# Altium schematic sheet GR740_GPIO.SchDoc
size A4
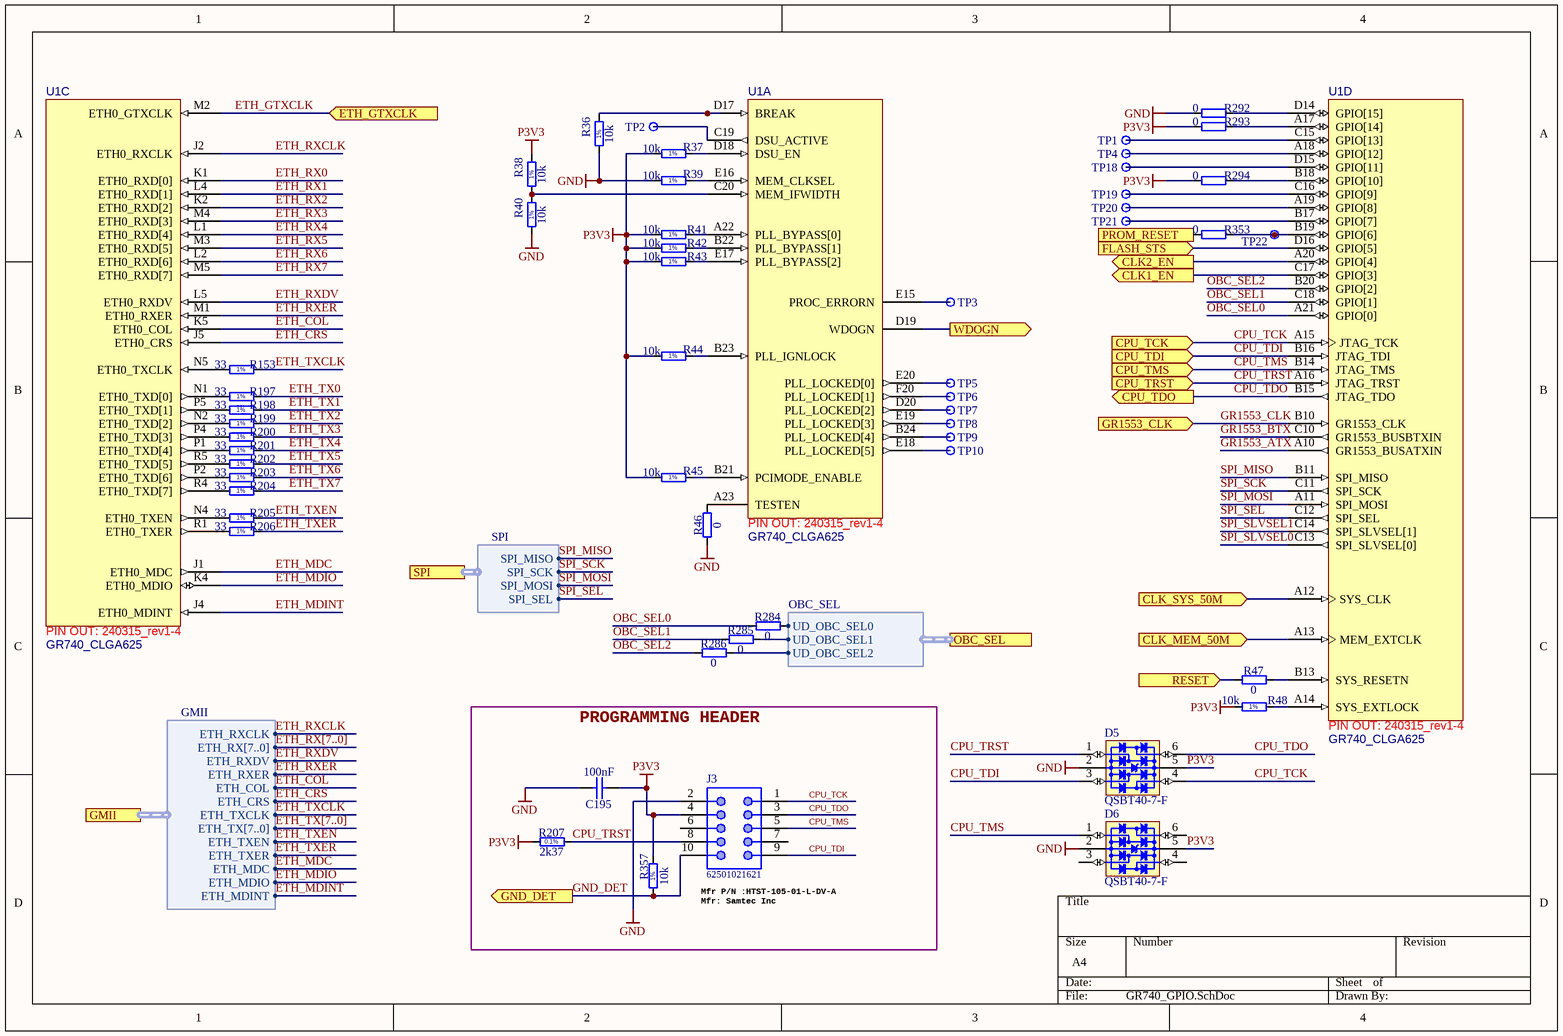
[diagram p0: GR740_GPIO.SchDoc]

## Parts
C195  100nF  [CAPC0603X33N]
D5  QSBT40-7-F  [SOT65P210X110-6N]
D6  QSBT40-7-F  [SOT65P210X110-6N]
J3  62501021621  [62501021621]
R36  10k  [RESC1005X40N]
R37  10k  [RESC1005X40N]
R38  10k  [RESC1005X40N]
R39  10k  [RESC1005X40N]
R40  10k  [RESC1005X40N]
R41  10k  [RESC1005X40N]
R42  10k  [RESC1005X40N]
R43  10k  [RESC1005X40N]
R44  10k  [RESC1005X40N]
R45  10k  [RESC1005X40N]
R46  0  [RESC1005X40N]
R47  0  [RESC1005X40N]
R48  10k  [RESC1005X40N]
R153  33  [RESC1005X40N]
R197  33  [RESC1005X40N]
R198  33  [RESC1005X40N]
R199  33  [RESC1005X40N]
R200  33  [RESC1005X40N]
R201  33  [RESC1005X40N]
R202  33  [RESC1005X40N]
R203  33  [RESC1005X40N]
R204  33  [RESC1005X40N]
R205  33  [RESC1005X40N]
R206  33  [RESC1005X40N]
R207  2k37  [RESC1608X55N]
R284  0  [RESC1005X40N]
R285  0  [RESC1005X40N]
R286  0  [RESC1005X40N]
R292  0  [RESC0603X28N]
R293  0  [RESC0603X28N]
R294  0  [RESC0603X28N]
R353  0  [RESC0603X28N]
R357  10k  [RESC1005X40N]
TP1  Test Point  [TPS127]  (value not drawn)
TP2  Test Point  [TPS127]  (value not drawn)
TP3  Test Point  [TPS127]  (value not drawn)
TP4  Test Point  [TPS127]  (value not drawn)
TP5  Test Point  [TPS127]  (value not drawn)
TP6  Test Point  [TPS127]  (value not drawn)
TP7  Test Point  [TPS127]  (value not drawn)
TP8  Test Point  [TPS127]  (value not drawn)
TP9  Test Point  [TPS127]  (value not drawn)
TP10  Test Point  [TPS127]  (value not drawn)
TP18  Test Point  [TPS127]  (value not drawn)
TP19  Test Point  [TPS127]  (value not drawn)
TP20  Test Point  [TPS127]  (value not drawn)
TP21  Test Point  [TPS127]  (value not drawn)
TP22  Test Point  [TPS127]  (value not drawn)
U1  GR740_CLGA625  [BGA625C100P25X25_3182X3182X1543]  (parts A,C,D of 10)

## Blocks framed on the sheet
PROGRAMMING HEADER: C195 J3 R207 R357

## Ports
CLK1_EN (out), CLK2_EN (out), CLK_MEM_50M (in), CLK_SYS_50M (in), CPU_TCK (in), CPU_TDI (in), CPU_TDO (out), CPU_TMS (in), CPU_TRST (in), ETH_GTXCLK (in), FLASH_STS (in), GMII (harness GMII), GND_DET (out), GR1553_CLK (in), OBC_SEL (harness OBC_SEL), PROM_RESET (out), RESET (in), SPI (harness SPI), WDOGN (out)

## Harnesses
GMII: ETH_RXCLK, ETH_RX[7..0], ETH_RXDV, ETH_RXER, ETH_COL, ETH_CRS, ETH_TXCLK, ETH_TX[7..0], ETH_TXEN, ETH_TXER, ETH_MDC, ETH_MDIO, ETH_MDINT
SPI: SPI_MISO, SPI_SCK, SPI_MOSI, SPI_SEL
OBC_SEL: UD_OBC_SEL0, UD_OBC_SEL1, UD_OBC_SEL2

## Nets
GND: C195.2 D5.2(GND) D6.2(GND) J3.2 R36.1 R39.1 R40.1 R46.1 R292.1
P3V3: C195.1 D5.5(VBUS) D6.5(VBUS) J3.4 R37.1 R38.2 R41.1 R42.1 R43.1 R44.1 R45.1 R48.1 R207.1 R293.1 R294.1 R357.2
CLK1_EN: U1.C17(GPIO[3]) ; port CLK1_EN
CLK2_EN: U1.A20(GPIO[4]) ; port CLK2_EN
CLK_MEM_50M: U1.A13(MEM_EXTCLK) ; port CLK_MEM_50M
CLK_SYS_50M: U1.A12(SYS_CLK) ; port CLK_SYS_50M
CPU_TCK: D5.4(I/O3) J3.1 U1.A15(JTAG_TCK) ; port CPU_TCK
CPU_TDI: D5.3(I/O2) J3.9 U1.B16(JTAG_TDI) ; port CPU_TDI
CPU_TDO: D5.6(I/O4) J3.3 U1.B15(JTAG_TDO) ; port CPU_TDO
CPU_TMS: D6.1(I/O1) J3.5 U1.B14(JTAG_TMS) ; port CPU_TMS
CPU_TRST: D5.1(I/O1) J3.8 R207.2 U1.A16(JTAG_TRST) ; port CPU_TRST
ETH_COL: U1.K5(ETH0_COL) ; port GMII.ETH_COL
ETH_CRS: U1.J5(ETH0_CRS) ; port GMII.ETH_CRS
ETH_GTXCLK: U1.M2(ETH0_GTXCLK) ; port ETH_GTXCLK
ETH_MDC: U1.J1(ETH0_MDC) ; port GMII.ETH_MDC
ETH_MDINT: U1.J4(ETH0_MDINT) ; port GMII.ETH_MDINT
ETH_MDIO: U1.K4(ETH0_MDIO) ; port GMII.ETH_MDIO
ETH_RX0: U1.K1(ETH0_RXD[0])
ETH_RX1: U1.L4(ETH0_RXD[1])
ETH_RX2: U1.K2(ETH0_RXD[2])
ETH_RX3: U1.M4(ETH0_RXD[3])
ETH_RX4: U1.L1(ETH0_RXD[4])
ETH_RX5: U1.M3(ETH0_RXD[5])
ETH_RX6: U1.L2(ETH0_RXD[6])
ETH_RX7: U1.M5(ETH0_RXD[7])
ETH_RXCLK: U1.J2(ETH0_RXCLK) ; port GMII.ETH_RXCLK
ETH_RXDV: U1.L5(ETH0_RXDV) ; port GMII.ETH_RXDV
ETH_RXER: U1.M1(ETH0_RXER) ; port GMII.ETH_RXER
ETH_TX0: R197.2
ETH_TX1: R198.2
ETH_TX2: R199.2
ETH_TX3: R200.2
ETH_TX4: R201.2
ETH_TX5: R202.2
ETH_TX6: R203.2
ETH_TX7: R204.2
ETH_TXCLK: R153.2 ; port GMII.ETH_TXCLK
ETH_TXEN: R205.2 ; port GMII.ETH_TXEN
ETH_TXER: R206.2 ; port GMII.ETH_TXER
FLASH_STS: U1.D16(GPIO[5]) ; port FLASH_STS
GND_DET: J3.10 R357.1 ; port GND_DET
GR1553_ATX: U1.A10(GR1553_BUSATXIN)
GR1553_BTX: U1.C10(GR1553_BUSBTXIN)
GR1553_CLK: U1.B10(GR1553_CLK) ; port GR1553_CLK
OBC_SEL0: R284.1 U1.A21(GPIO[0])
OBC_SEL1: R285.1 U1.C18(GPIO[1])
OBC_SEL2: R286.1 U1.B20(GPIO[2])
PROM_RESET: R353.1 ; port PROM_RESET
RESET: R47.1 ; port RESET
SPI_MISO: U1.B11(SPI_MISO) ; port SPI.SPI_MISO
SPI_MOSI: U1.A11(SPI_MOSI) ; port SPI.SPI_MOSI
SPI_SCK: U1.C11(SPI_SCK) ; port SPI.SPI_SCK
SPI_SEL: U1.C12(SPI_SEL) ; port SPI.SPI_SEL
SPI_SLVSEL0: U1.C13(SPI_SLVSEL[0])
SPI_SLVSEL1: U1.C14(SPI_SLVSEL[1])
WDOGN: U1.D19(WDOGN) ; port WDOGN
NetR36_2: R36.2 U1.D17(BREAK)
NetR37_2: R37.2 U1.D18(DSU_EN)
NetR38_1: R38.1 R40.2 U1.C20(MEM_IFWIDTH)
NetR39_2: R39.2 U1.E16(MEM_CLKSEL)
NetR41_2: R41.2 U1.A22(PLL_BYPASS[0])
NetR42_2: R42.2 U1.B22(PLL_BYPASS[1])
NetR43_2: R43.2 U1.E17(PLL_BYPASS[2])
NetR44_2: R44.2 U1.B23(PLL_IGNLOCK)
NetR45_2: R45.2 U1.B21(PCIMODE_ENABLE)
NetR46_2: R46.2 U1.A23(TESTEN)
NetR47_2: R47.2 U1.B13(SYS_RESETN)
NetR48_2: R48.2 U1.A14(SYS_EXTLOCK)
NetR153_1: R153.1 U1.N5(ETH0_TXCLK)
NetR197_1: R197.1 U1.N1(ETH0_TXD[0])
NetR198_1: R198.1 U1.P5(ETH0_TXD[1])
NetR199_1: R199.1 U1.N2(ETH0_TXD[2])
NetR200_1: R200.1 U1.P4(ETH0_TXD[3])
NetR201_1: R201.1 U1.P1(ETH0_TXD[4])
NetR202_1: R202.1 U1.R5(ETH0_TXD[5])
NetR203_1: R203.1 U1.P2(ETH0_TXD[6])
NetR204_1: R204.1 U1.R4(ETH0_TXD[7])
NetR205_1: R205.1 U1.N4(ETH0_TXEN)
NetR206_1: R206.1 U1.R1(ETH0_TXER)
NetR284_2: R284.2 ; port OBC_SEL.UD_OBC_SEL0
NetR285_2: R285.2 ; port OBC_SEL.UD_OBC_SEL1
NetR286_2: R286.2 ; port OBC_SEL.UD_OBC_SEL2
NetR292_2: R292.2 U1.D14(GPIO[15])
NetR293_2: R293.2 U1.A17(GPIO[14])
NetR294_2: R294.2 U1.B18(GPIO[10])
NetR353_2: R353.2 TP22.1 U1.B19(GPIO[6])
NetTP1_1: TP1.1 U1.C15(GPIO[13])
NetTP2_1: TP2.1 U1.C19(DSU_ACTIVE)
NetTP3_1: TP3.1 U1.E15(PROC_ERRORN)
NetTP4_1: TP4.1 U1.A18(GPIO[12])
NetTP5_1: TP5.1 U1.E20(PLL_LOCKED[0])
NetTP6_1: TP6.1 U1.F20(PLL_LOCKED[1])
NetTP7_1: TP7.1 U1.D20(PLL_LOCKED[2])
NetTP8_1: TP8.1 U1.E19(PLL_LOCKED[3])
NetTP9_1: TP9.1 U1.B24(PLL_LOCKED[4])
NetTP10_1: TP10.1 U1.E18(PLL_LOCKED[5])
NetTP18_1: TP18.1 U1.D15(GPIO[11])
NetTP19_1: TP19.1 U1.C16(GPIO[9])
NetTP20_1: TP20.1 U1.A19(GPIO[8])
NetTP21_1: TP21.1 U1.B17(GPIO[7])

Not connected (* = marked no-connect by the designer): D6 3(I/O2) 4(I/O3) 6(I/O4); J3 6 7

## Buses and harness runs
bus ETH_RX[7..0]
bus ETH_TX[7..0]

## Notes on the sheet
- Mfr P/N :HTST-105-01-L-DV-A
  Mfr: Samtec Inc
- (in symbol GR740_CLGA625, part A) PIN OUT: 240315_rev1-4
- (in symbol GR740_CLGA625, part C) PIN OUT: 240315_rev1-4
- (in symbol GR740_CLGA625, part D) PIN OUT: 240315_rev1-4
- (in symbol R0402_10K_1%_0.0625W_100PPM) 1%
- (in symbol R0402_33R_1%_0.0625W_100PPM) 1%
- (in symbol R0603_2K37_0.1%_0.063W_10PPM) 0.1%

## Library data of the parts
C195 = CC0201_100NF_6.3V_10%_X5R: Non-polarised capacitor; Manufacturer: GENERIC; Part Description: SMD Multilayer Chip Ceramic Capacitor; Manufacturer1 Part Number: 02016D104KAT2A; Voltage: 6.3V; TC: X5R; Tolerance: ±10%; Part Number: CC0201_100NF_6.3V_10%_X5R; Component Kind: Standard; Component Type: Standard; Pin Count: 2; Value: 100nF; Status: Not Recommended; Manufacturer Part Number: CC0201_100NF_6.3V_10%_X5R; Case: 0201; Mounted: Yes; Socket: No; SMD: Yes; Sense: No; Manufacturer1 Example: AVX; Manufacturer1 ComponentHeight: 0.33mm; HelpURL: \\cern.ch\dfs\Applications\Altium\Datasheets\CC0201_X5R_AVX.pdf; Author: CERN DEM JLC; CreateDate: 03/12/2007; LatestRevisionDate: 03/12/2007
D5 D6 = D_TVS_QSBT40-7-F: Bonding: No; PressFit: No; Case: *; Component Kind: Standard; Component Type: Standard; ComponentHeigth: *; CreateDate: 2018-01-01; Device: QSBT40-7-F; Footprint: SOT363; HelpURL: *; LatestRevisionDate: 2018-01-01; Manufacturer: *; Manufacturer Part Number: QSBT40-7-F; Mounted: Yes; PackageDescription: *; Part Description: *; Part Number: *; Pin Count: 6; Sense: No; SMD: Yes; Socket: No; Value: *
J3 = 62501021621: Male Box Header WR-BHD with long lever, THT, Vertical, pitch 2.00 mm, 10 pins; Pin Number: 10; Pitch: 2.00 mm; Working Voltage: 250 VAC; Withstanding Voltage: 500 VAC; Contact Resistance: 20 mOhm; ComponentLink1Description: Manufacturer; ComponentLink1URL: http://www.we-online.de; ComponentLink2Description: Datasheet; ComponentLink2URL: https://katalog.we-online.de/em/datasheet/6250xx21621.pdf; Part Number: 62501021621; Published Date: August 2018; Publisher: Wurth Elektronik; Operating Temperature: -40 to 125 degC; Packaging: Tray; Gender: Male; Mounting Technology: THT; Orientation: Vertical
R36-R45 R48 R357 = R0402_10K_1%_0.0625W_100PPM: Resistor - 1%; Manufacturer: GENERIC; Part Description: General Purpose Thick Film Chip Resistor; Manufacturer1 Part Number: 232270671003L; TC: ±100ppm/°C; PressFit: No; Manufacturer Part Number: R0402_10K_1%_0.0625W_100PPM; Part Number: R0402_10K_1%_0.0625W_100PPM; Tolerance: ±1%; Value: 10k; Component Kind: Standard; Component Type: Standard; Pin Count: 2; Status: Not Recommended; Power: 0.0625W; Case: 0402; Mounted: Yes; Sense: No; Socket: No; SMD: Yes; Manufacturer1 Example: YAGEO PHYCOMP; Manufacturer1 ComponentHeight: 0.4mm; HelpURL: \\cern.ch\dfs\Applications\Altium\Datasheets\R0402_Phycomp_RC0402.pdf; Author: CERN DEM JLC; CreateDate: 03/12/2007; LatestRevisionDate: 17/10/2012
R46 R47 R284-R286 = R0402_0R_JUMPER: Resistor; Part Description: 1A (0.05R Max DC Resistance) Zero Ohm Jumper; Manufacturer: GENERIC; Manufacturer1 Part Number: 232270591001L; PressFit: No; Part Number: R0402_0R_JUMPER; Component Kind: Standard; Component Type: Standard; Pin Count: 2; Value: 0; Status: Not Recommended; Manufacturer Part Number: R0402_0R_JUMPER; Case: 0402; Mounted: Yes; Sense: No; Socket: No; SMD: Yes; Manufacturer1 Example: YAGEO PHYCOMP; Manufacturer1 ComponentHeight: 0.4mm; HelpURL: \\cern.ch\dfs\Applications\Altium\Datasheets\R0402_Phycomp_RC0402.pdf; Author: CERN DEM JLC; CreateDate: 03.12.2007; LatestRevisionDate: 17.10.2012
R153 R197-R206 = R0402_33R_1%_0.0625W_100PPM: Resistor - 1%; Part Description: General Purpose Thick Film Chip Resistor; Manufacturer: GENERIC; Manufacturer1 Part Number: 232270673309L; TC: ±100ppm/°C; PressFit: No; Part Number: R0402_33R_1%_0.0625W_100PPM; Component Kind: Standard; Component Type: Standard; Pin Count: 2; Value: 33; Status: Not Recommended; Power: 0.0625W; Tolerance: ±1%; Manufacturer Part Number: R0402_33R_1%_0.0625W_100PPM; Case: 0402; Mounted: Yes; Sense: No; Socket: No; SMD: Yes; Manufacturer1 Example: YAGEO PHYCOMP; Manufacturer1 ComponentHeight: 0.4mm; HelpURL: \\cern.ch\dfs\Applications\Altium\Datasheets\R0402_Phycomp_RC0402.pdf; Author: CERN DEM JLC; CreateDate: 03.12.2007; LatestRevisionDate: 17.10.2012
R207 = R0603_2K37_0.1%_0.063W_10PPM: Resistor - 0.1%; Part Description: Thin Film Chip Resistor; Manufacturer: GENERIC; Manufacturer1 Part Number: RN73C1J2K37BTDF; Power: 0.063W; TC: ±10ppm; PressFit: No; Part Number: R0603_2K37_0.1%_0.063W_10PPM; Component Kind: Standard; Component Type: Standard; Pin Count: 2; Value: 2k37; Status: Not Recommended; Tolerance: ±0.1%; Manufacturer Part Number: R0603_2K37_0.1%_0.063W_10PPM; Case: 0603; Mounted: Yes; Sense: No; Socket: No; SMD: Yes; Manufacturer1 Example: TYCO HOLSWORTHY; Manufacturer1 ComponentHeight: 0.5mm; HelpURL: \\cern.ch\dfs\Applications\Altium\Datasheets\R0603_Tyco_RN73.pdf; Author: CERN DEM JLC; CreateDate: 03.12.2007; LatestRevisionDate: 13.03.2008
R292-R294 R353 = R0201_0R_JUMPER: Resistor; Part Description: 1A (0.05R Max DC Resistance) Zero Ohm Jumper; Manufacturer: GENERIC; Manufacturer1 Part Number: CRCW02010000Z0ED; PressFit: No; Part Number: R0201_0R_JUMPER; Component Kind: Standard; Component Type: Standard; Pin Count: 2; Value: 0; Status: Not Recommended; Manufacturer Part Number: R0201_0R_JUMPER; Case: 0201; Mounted: Yes; Sense: No; Socket: No; SMD: Yes; Manufacturer1 Example: VISHAY; Manufacturer1 ComponentHeight: 0.27mm; HelpURL: \\cern.ch\dfs\Applications\Altium\Datasheets\R0201_VISHAY_CRCW e3.pdf; Author: CERN DEM JLC; CreateDate: 19.11.2014; LatestRevisionDate: 08.01.2015
TP1-TP10 TP18-TP22 = SMD_PAD_1.27X1.27MM: Part Description: 1.27mm x 1.27mm PCB Copper Area (SMD Test Point); Mounted: No; Part Number: SMD_PAD_1.27X1.27MM; Component Kind: Standard (No BOM); Component Type: Standard (No BOM); Pin Count: 1; Family: Test Point; Socket: No; SMD: No; Sense: No; Status: None; ComponentHeight: 0mm; HelpURL: Undefined; Author: CERN DEM JLC; CreateDate: 12.01.2008; LatestRevisionDate: 12.01.2008; PackageDescription: 1.27mm x 1.27mm PCB Copper Area (SMD Test Point)
U1 = GR740_CLGA625: Category: IC; Technology: SMD